# Altium schematic sheet ThermoCoupleCircuit.SchDoc
size A; SheetNumber: 7; SheetTotal: 9
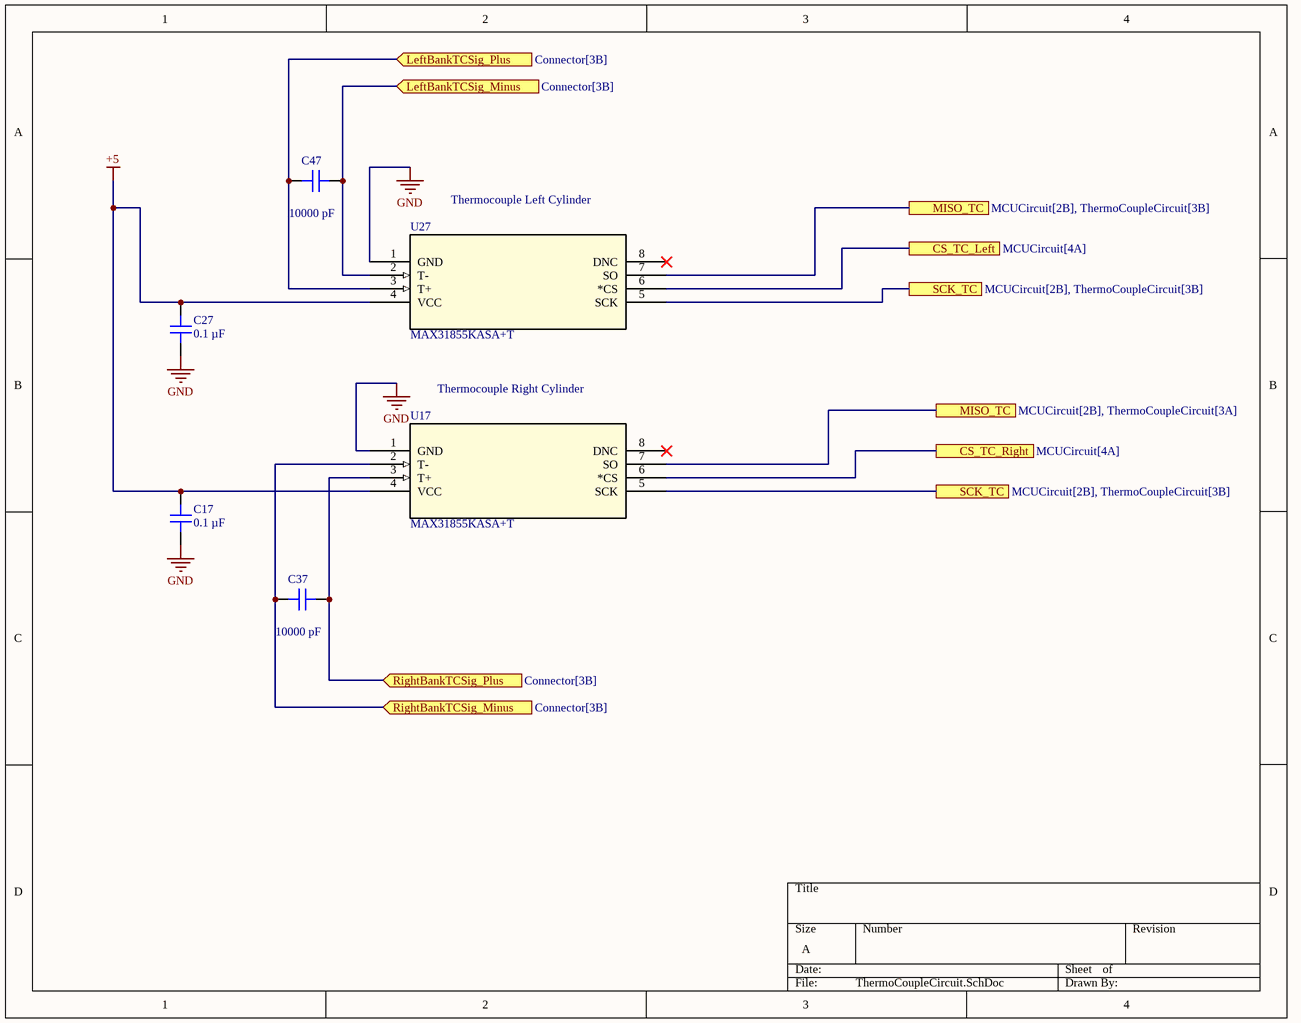
[diagram p0: ThermoCoupleCircuit.SchDoc]

## Parts
C17  0.1 µF  [C0805]
C27  0.1 µF  [C0805]
C37  10000 pF  [C0805]
C47  10000 pF  [C0805]
U17  MAX31855KASA+T  [21-0041B_8_MXM]
U27  MAX31855KASA+T  [21-0041B_8_MXM]

## Ports
CS_TC_Left (see MCUCircuit[4A]), CS_TC_Right (see MCUCircuit[4A]), LeftBankTCSig_Minus (in, see Connector[3B]), LeftBankTCSig_Plus (in, see Connector[3B]), MISO_TC (see MCUCircuit[2B], ThermoCoupleCircuit[3A]), MISO_TC (see MCUCircuit[2B], ThermoCoupleCircuit[3B]), RightBankTCSig_Minus (in, see Connector[3B]), RightBankTCSig_Plus (in, see Connector[3B]), SCK_TC (see MCUCircuit[2B], ThermoCoupleCircuit[3B])

## Nets
+5: C17.2 C27.1 U17.4(VCC) U27.4(VCC)
GND: C17.1 C27.2 U17.1(GND) U27.1(GND)
CS_TC_Left: U27.6(*CS) ; port CS_TC_Left
CS_TC_Right: U17.6(*CS) ; port CS_TC_Right
LeftBankTCSig_Minus: C47.2 U27.2(T-) ; port LeftBankTCSig_Minus
LeftBankTCSig_Plus: C47.1 U27.3(T+) ; port LeftBankTCSig_Plus
MISO_TC: U17.7(SO) U27.7(SO) ; port MISO_TC
RightBankTCSig_Minus: C37.1 U17.2(T-) ; port RightBankTCSig_Minus
RightBankTCSig_Plus: C37.2 U17.3(T+) ; port RightBankTCSig_Plus
SCK_TC: U17.5(SCK) U27.5(SCK) ; port SCK_TC

Not connected (* = marked no-connect by the designer): U17 8(DNC)*; U27 8(DNC)*

## Notes on the sheet
- Thermocouple Left Cylinder
- Thermocouple Right Cylinder

## Library data of the parts
C17 C27 = 0805B104K160CT: CAP CER 0.1UF 16V X7R 0805; manufacturer: Walsin Technology Corporation; Tolerance: ±10%; Part Number: 0805B104K160CT; Value: 0.1 µF; Applications: General Purpose; Capacitance: 0.1 µF; componentlink1description: Datasheet; componentlink1url: http://www.passivecomponent.com/wp-content/uploads/2018/10/MLCC.pdf; componentlink2description: DigiKey Link; componentlink2url: https://www.digikey.com/en/products/detail/walsin-technology-corporation/0805B104K160CT/9355062; Device Package: 0805 (2012 Metric); lastupdated: 2/9/2024 20:16:02; Lifecycle Status: Active; Minimum Order: 1; Mounting Type: Surface Mount, MLCC; Operating Temperature: -55°C ~ 125°C; Package / Case: 0805 (2012 Metric); packaging: TapeAndReel; partid: 4882; Part Status: Active; price: 0.01; series: -; Size / Dimension: 0.079" L x 0.049" W (2.00mm x 1.25mm); Supplier 1: DigiKey; Supplier Part Number 1: 1292-1565-1-ND; Temperature Coefficient: X7R; Thickness (Max): 0.035" (0.90mm); Voltage - Rated: 16V
C37 C47 = C0805C103K4REC7800: CAP CER 0805 10NF 16V X7R 10%; manufacturer: KEMET; Part Number: C0805C103K4REC7800; Value: 10000 pF; Applications: ESD Protection; Capacitance: 10000 pF; componentlink1description: Datasheet; componentlink1url: https://connect.kemet.com:7667/gateway/IntelliData-ComponentDocumentation/1.0/download/datasheet/C0805C103K4REC7800; componentlink2description: DigiKey Link; componentlink2url: https://www.digikey.com/en/products/detail/kemet/C0805C103K4REC7800/8643796; Device Package: 0805 (2012 Metric); lastupdated: 2/9/2024 20:14:57; Lifecycle Status: Active; Minimum Order: 1; Mounting Type: Surface Mount, MLCC; Operating Temperature: -55°C ~ 125°C; Package / Case: 0805 (2012 Metric); packaging: TapeAndReel; partid: 46019; Part Status: Active; price: 0.03; series: ESD SMD Comm X7R; Size / Dimension: 0.079" L x 0.049" W (2.00mm x 1.25mm); Supplier 1: DigiKey; Supplier Part Number 1: 399-C0805C103K4REC7800CT-ND; Temperature Coefficient: X7R; Thickness (Max): 0.035" (0.88mm); Tolerance: ±10%; Voltage - Rated: 16V
U17 U27 = MAX31855KASA+T: No Description Available; Mfr_Name: Analog Devices Inc; RefDes: RefDes; Type: Type